# EAGLE schematic Pull_Up:Down_Resistors (EAGLE 8.6.1)
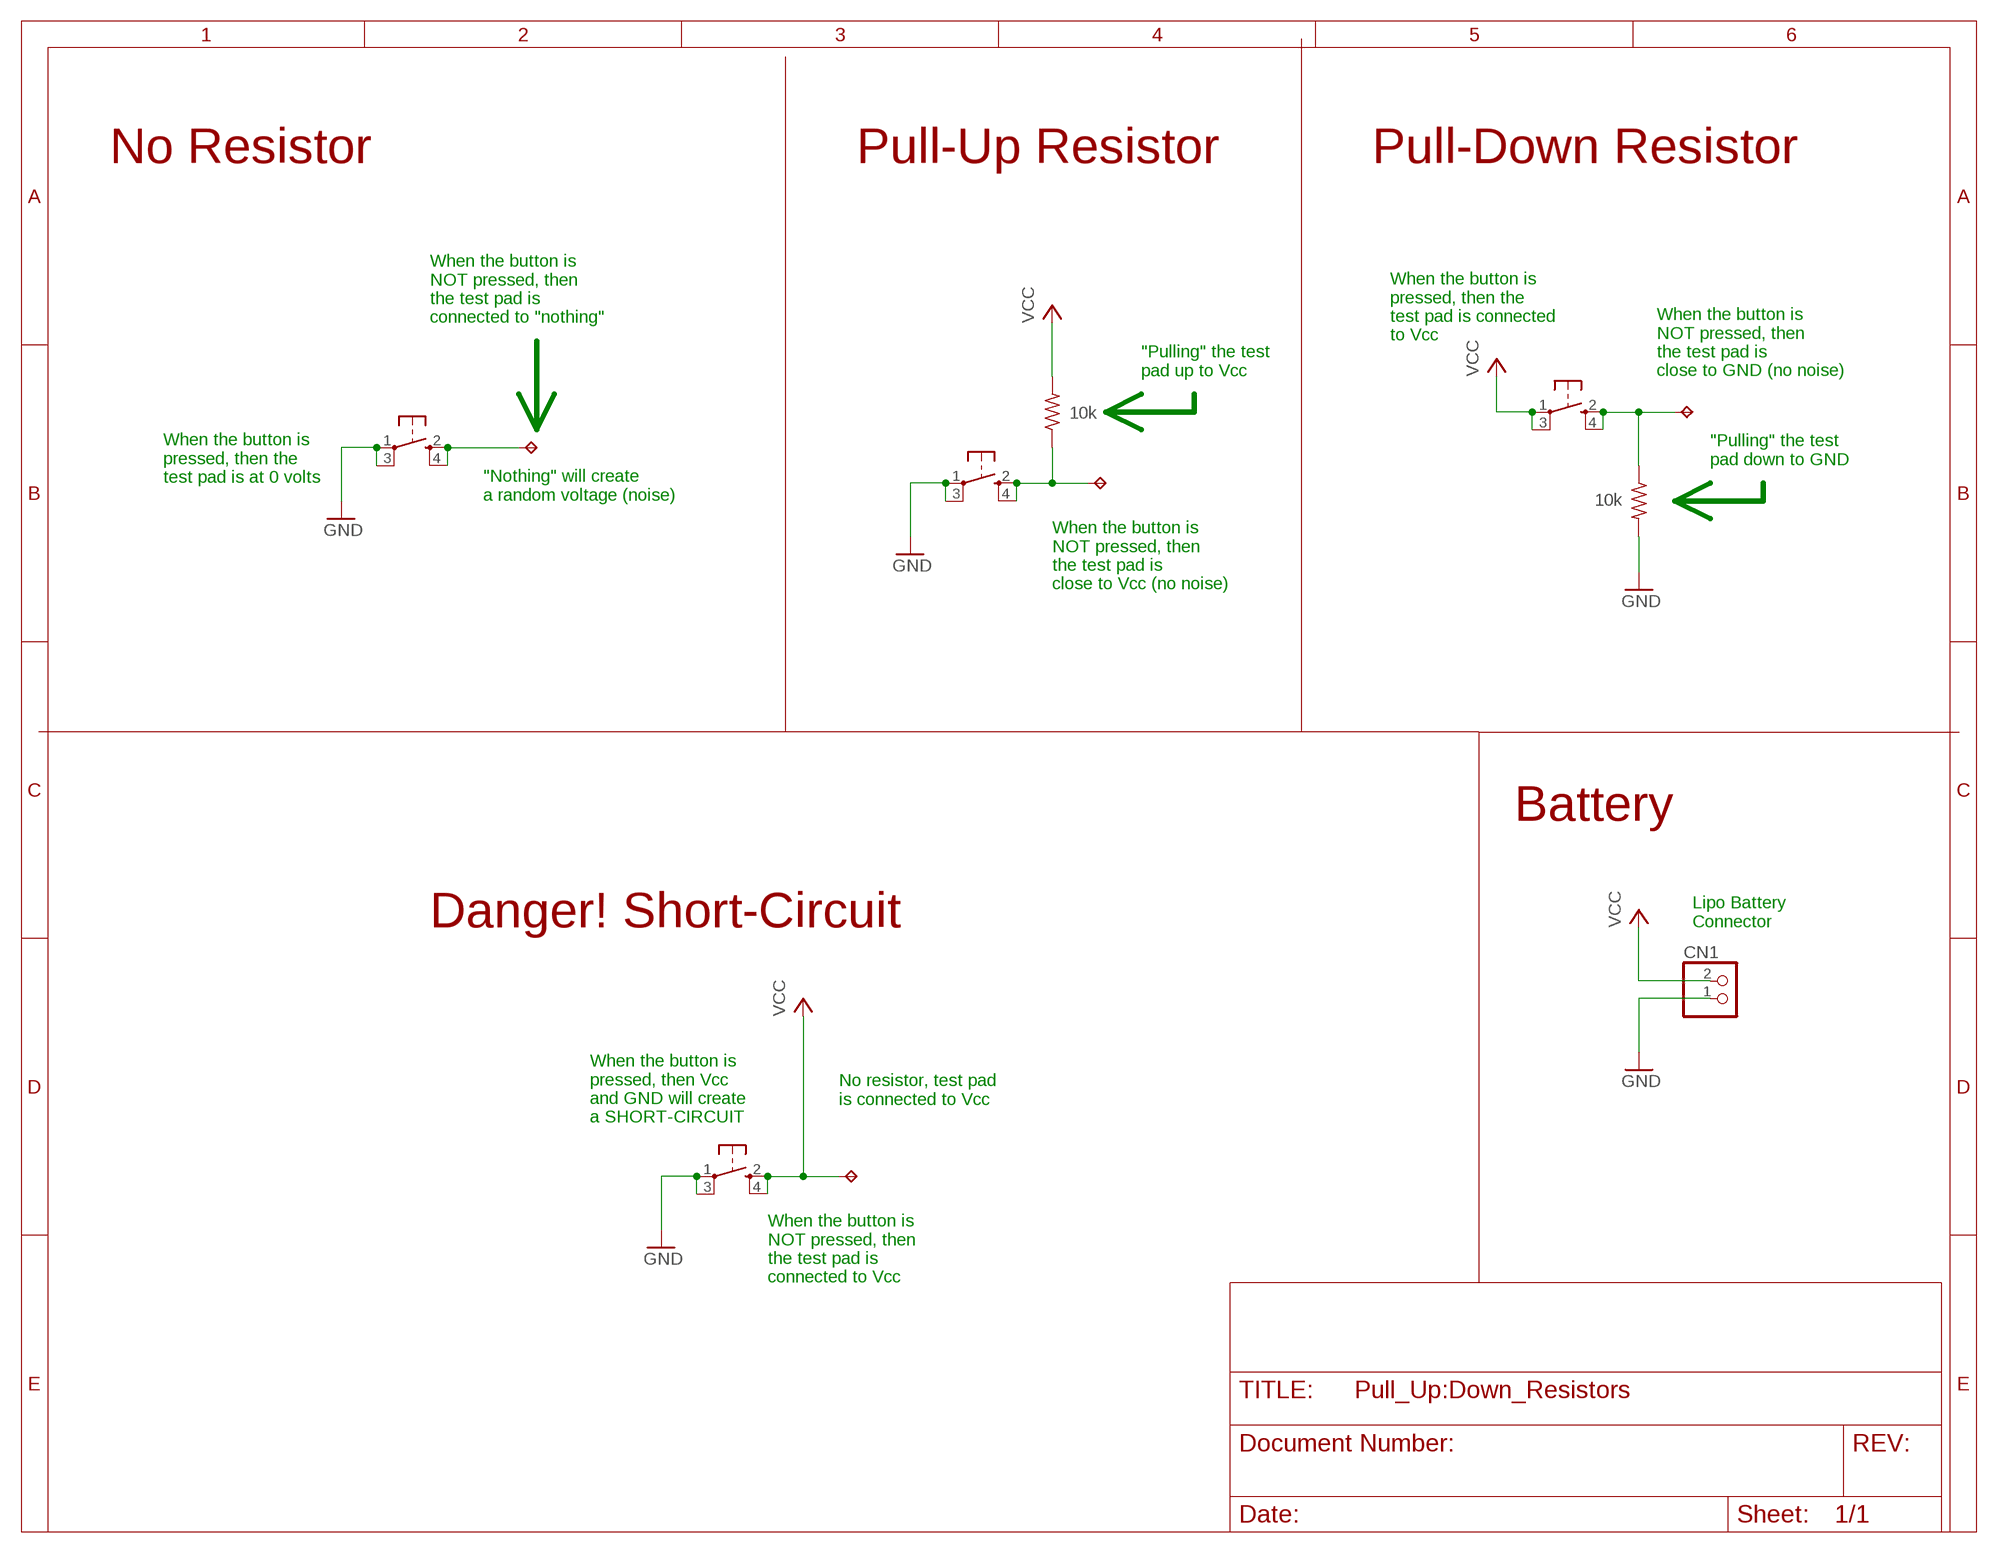
[diagram p0: schematic, sheet 1]

## Parts
CN1  JST_2PIN-SMT-RA  [JST-PH-2-SMT-RA]
R1  10k  R-US_R0603  [R0603]
R2  10k  R-US_R0603  [R0603]
SW1  SPST_TACT-KMR2  [KMR2]
SW2  SPST_TACT-KMR2  [KMR2]
SW3  SPST_TACT-KMR2  [KMR2]
SW4  SPST_TACT-KMR2  [KMR2]
TP1  TPTP20R  [TP20R]
TP2  TPTP20R  [TP20R]
TP3  TPTP20R  [TP20R]
TP4  TPTP20R  [TP20R]

## Nets
GND: CN1.1 R2.2 SW1.1(P) SW1.3(P1) SW2.1(P) SW2.3(P1) SW3.1(P) SW3.3(P1)
N$2: R1.1 SW2.2(S) SW2.4(S1) TP2.TP
N$3: SW1.2(S) SW1.4(S1) TP1.TP
N$5: R2.1 SW4.2(S) SW4.4(S1) TP4.TP
VCC: CN1.2 R1.2 SW3.2(S) SW3.4(S1) SW4.1(P) SW4.3(P1) TP3.TP

## Notes on the sheet
- No Resistor | Pull-Up Resistor | Pull-Down Resistor
- When the button is
  NOT pressed, then
  the test pad is
  connected to "nothing"
- When the button is
  pressed, then the
  test pad is connected
  to Vcc
- "Pulling" the test
  pad up to Vcc
- When the button is
  NOT pressed, then
  the test pad is
  close to GND (no noise)
- "Pulling" the test
  pad down to GND
- When the button is
  pressed, then the
  test pad is at 0 volts
- "Nothing" will create
  a random voltage (noise)
- When the button is
  NOT pressed, then
  the test pad is
  close to Vcc (no noise)
- Battery
- Danger! Short-Circuit
- Lipo Battery
  Connector
- No resistor, test pad
  is connected to Vcc
- When the button is
  pressed, then Vcc
  and GND will create
  a SHORT-CIRCUIT
- When the button is
  NOT pressed, then
  the test pad is
  connected to Vcc

## Library data of the parts
CN1 = adafruit:JST_2PIN: JST 2-Pin Connectors of various flavors SMT-RA (S2B-PH-SM4) 4UConnector #17311 SMT (B2B-PH-SM4) THM-RA (S2B-PH) THM (B2B-PH)
R1 R2 = adafruit:R-US_: RESISTOR, American symbol
SW1-SW4 = adafruit:SPST_TACT: SMT 6mm switch, EVQQ2 series http://www.ladyada.net/library/eagle
TP1-TP4 = testpad:TP: Test pad